# EAGLE schematic Base Station 1.7 (EAGLE 7.3.0)
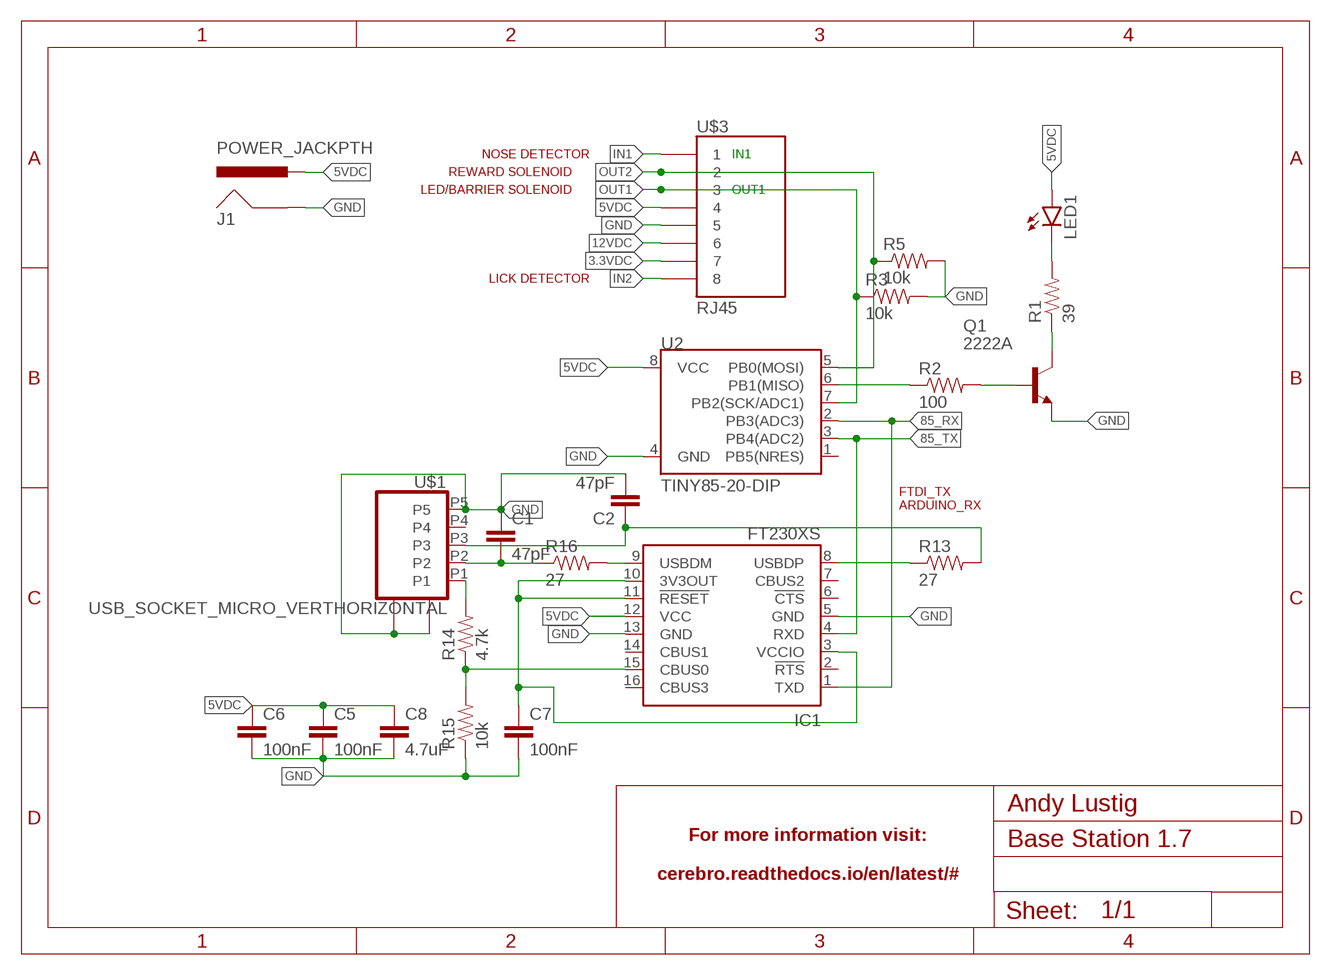
[diagram p0: schematic, sheet 1]

## Parts
C1  47pF  CAPPTH  [CAP-PTH-SMALL]
C2  47pF  CAPPTH  [CAP-PTH-SMALL]
C5  100nF  CAPPTH  [CAP-PTH-SMALL]
C6  100nF  CAPPTH  [CAP-PTH-SMALL]
C7  100nF  CAPPTH  [CAP-PTH-SMALL]
C8  4.7uF  CAPPTH  [CAP-PTH-SMALL]
IC1  FT230XS  [SSOP16]
J1  POWER_JACKPTH  [POWER_JACK_PTH]
LED1  LED  [PLCC-2]
Q1  2222A  2N2222  [TO92-EBC-OVAL]
R1  39  RESISTORPTH-1/4W-VERT  [AXIAL-0.1]
R2  100  RESISTORPTH-1/4W-VERT  [AXIAL-0.1]
R3  10k  RESISTORPTH-1/4W-VERT  [AXIAL-0.1]
R5  10k  RESISTORPTH-1/4W-VERT  [AXIAL-0.1]
R13  27  RESISTORPTH-1/4W-VERT  [AXIAL-0.1]
R14  4.7k  RESISTORPTH-1/4W-VERT  [AXIAL-0.1]
R15  10k  RESISTORPTH-1/4W-VERT  [AXIAL-0.1]
R16  27  RESISTORPTH-1/4W-VERT  [AXIAL-0.1]
U2  TINY85-20-DIP  ATTINY45TINY85-20-DIP  [DIP08]
U$1  USB_SOCKET_MICRO_VERTHORIZONTAL  [USB_HORZ_MICRO_SMD]
U$3  RJ45  [RJ45-8]

## Nets
3.3VDC: U$3.7
5VDC: C5.1 C6.1 C8.1 IC1.12(VCC) J1.PWR LED1.ANODE(A) U2.8(VCC) U$3.4
12VDC: U$3.6
85_RX: IC1.1(TXD) U2.2(PB3(ADC3))
85_TX: IC1.4(RXD) U2.3(PB4(ADC2))
GND: C1.1 C2.2 C5.2 C6.2 C7.2 C8.2 IC1.5(GND) IC1.13(GND) J1.GND Q1.E R3.P$2 R5.P$2 R15.P$1 U2.4(GND) U$1.G1 U$1.G2 U$1.P5 U$3.5
IN1: U$3.1
IN2: U$3.8
N$1: Q1.C R1.P$1
N$2: LED1.CATHODE(C) R1.P$2
N$4: R2.P$1 U2.6(PB1(MISO))
N$5: Q1.B R2.P$2
N$9: C1.2 R16.P$1 U$1.P2
N$10: C2.1 R13.P$2 U$1.P3
N$12: R14.P$2 U$1.P1
N$13: IC1.9(USBDM) R16.P$2
N$16: C7.1 IC1.3(VCCIO) IC1.10(3V3OUT) IC1.11(!RESET)
N$17: IC1.15(CBUS0) R14.P$1 R15.P$2
N$18: IC1.8(USBDP) R13.P$1
OUT1: R3.P$1 U2.7(PB2(SCK/ADC1)) U$3.3
OUT2: R5.P$1 U2.5(PB0(MOSI)) U$3.2
Unconnected: IC1.2(!RTS) IC1.6(!CTS) IC1.7(CBUS2) IC1.14(CBUS1) IC1.16(CBUS3) U2.1(PB5(NRES)) U$1.P4

## Notes on the sheet
- NOSE DETECTOR | IN1
- REWARD SOLENOID
- LED/BARRIER SOLENOID | OUT1
- LICK DETECTOR
- FTDI_TX
  ARDUINO_RX

## Library data of the parts
C1 C2 C5-C8 = SparkFun-Capacitors:CAP: Capacitor Standard 0603 ceramic capacitor, and 0.1" leaded capacitor.
IC1 = ftdichip:FT230X: USB to BASIC UART IC Auto generated by make-symbol-device-package-bsdl.ulp Rev. 43 Source: Data sheet <http://www.ftdichip.com/Support/Documents/DataSheets/ICs/DS_FT230X.pdf>
J1 = Andy-library:POWER_JACK: Power Jack This is the standard 5.5mm barrel jack for power. The PTH is the most common, proven, reliable, footprint. The Slot footprint only works if the mill layer is transmitted to the PCB fab house so be warned. Mating wall wart : TOL-00298 (and others); PROD_ID: PRT-00119
LED1 = Andy-library:LED: LEDs Standard schematic elements and footprints for 5mm, 3mm, 1206, and 0603 sized LEDs. 5mm - Spark Fun Electronics SKU : COM-00529 (and others)
Q1 = Andy-library:2N2222: NPN TRANSISTOR Big oval pads
R1-R3 R5 R13-R16 = SparkFun-Resistors:RESISTOR: Resistor Basic schematic elements and footprints for 0603, 1206, and PTH resistors.
U2 = SparkFun-DigitalIC:ATTINY45: Atmel 8-pin 2/4/8kB flash uC; PROD_ID: IC-09445
U$1 = Andy-library:USB_SOCKET_MICRO_VERT: horizontal socket. Digikey 609-4616-1-ND
U$3 = Andy-library:RJ45